# EAGLE schematic LED_Heart (EAGLE 7.7.0)
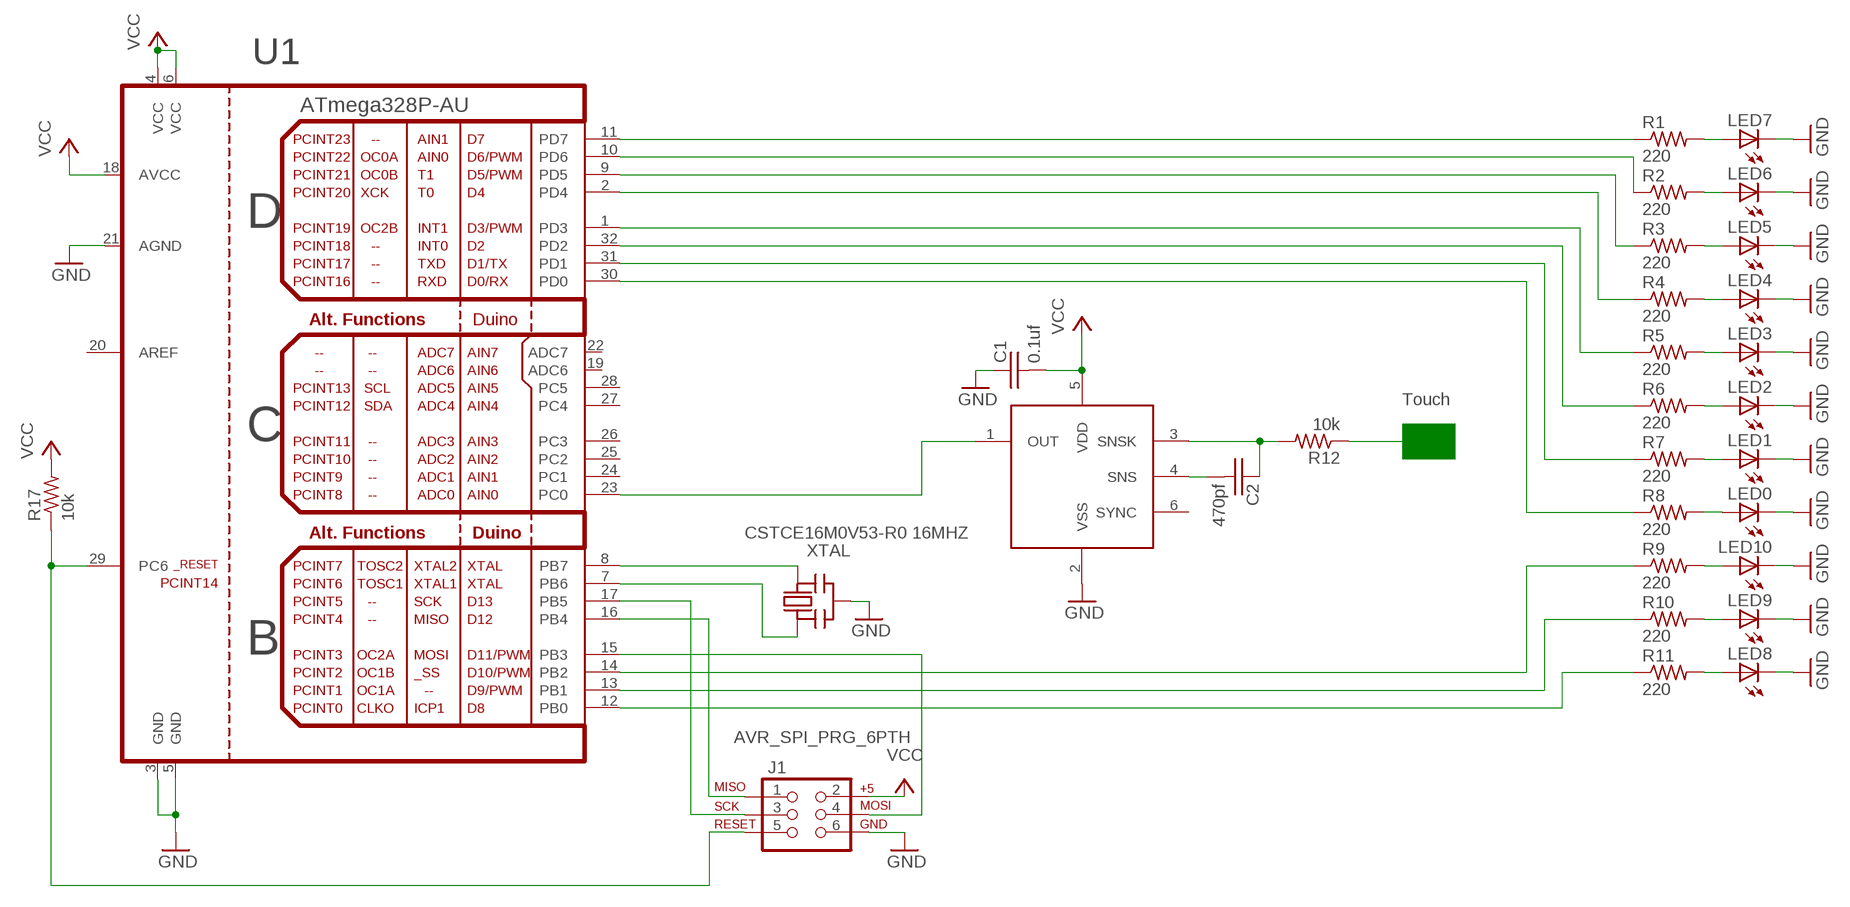
[diagram p0: schematic, sheet 1]

## Parts
C1  0.1uf  C-USC0603  [C0603]
C2  470pf  C-USC0603  [C0603]
J1  AVR_SPI_PRG_6PTH  [2X3]
LED0  LED0603  [LED-0603]
LED1  LED0603  [LED-0603]
LED2  LED0603  [LED-0603]
LED3  LED0603  [LED-0603]
LED4  LED0603  [LED-0603]
LED5  LED0603  [LED-0603]
LED6  LED0603  [LED-0603]
LED7  LED0603  [LED-0603]
LED8  LED0603  [LED-0603]
LED9  LED0603  [LED-0603]
LED10  LED0603  [LED-0603]
R1  220  R-US_R0402  [R0402]
R2  220  R-US_R0402  [R0402]
R3  220  R-US_R0402  [R0402]
R4  220  R-US_R0402  [R0402]
R5  220  R-US_R0402  [R0402]
R6  220  R-US_R0402  [R0402]
R7  220  R-US_R0402  [R0402]
R8  220  R-US_R0402  [R0402]
R9  220  R-US_R0402  [R0402]
R10  220  R-US_R0402  [R0402]
R11  220  R-US_R0402  [R0402]
R12  10k  R-US_R0402  [R0402]
R17  10k  R-US_R0402  [R0402]
U1  ATmega328P-AU  ATMEGA328  [TQFP-32-08]
U$1  QT100  [SOT23-6]
XTAL  CSTCE16M0V53-R0 16MHZ  CERMOSCILL-THM  [CERM_OSC]

## Nets
GND: C1.1 J1.6 LED0.C LED1.C LED2.C LED3.C LED4.C LED5.C LED6.C LED7.C LED8.C LED9.C LED10.C U1.3(GND) U1.5(GND) U1.21(AGND) U$1.2(VSS) XTAL.P$2(GND)
N$1: LED1.A R7.2
N$2: LED6.A R2.2
N$3: R9.1 U1.14(PB2)
N$4: U1.23(PC0) U$1.1(OUT)
N$6: C2.2 U$1.4(SNS)
N$7: C2.1 R12.2 U$1.3(SNSK)
N$8: R12.1
N$11: LED8.A R11.2
N$12: LED9.A R10.2
N$16: LED10.A R9.2
N$17: LED0.A R8.2
N$20: R10.1 U1.13(PB1)
N$22: LED2.A R6.2
N$23: LED3.A R5.2
N$28: LED5.A R3.2
N$30: R11.1 U1.12(PB0)
N$31: LED7.A R1.2
N$32: LED4.A R4.2
N$34: J1.5 R17.1 U1.29(PC6)
N$35: J1.3 U1.17(PB5)
N$36: J1.1 U1.16(PB4)
N$39: J1.4 U1.15(PB3)
PD0: R8.1 U1.30(PD0)
PD1: R7.1 U1.31(PD1)
PD2: R6.1 U1.32(PD2)
PD3: R5.1 U1.1(PD3)
PD4: R4.1 U1.2(PD4)
PD5: R3.1 U1.9(PD5)
PD6: R2.1 U1.10(PD6)
PD7: R1.1 U1.11(PD7)
VCC: C1.2 J1.2 R17.2 U1.4(VCC) U1.6(VCC) U1.18(AVCC) U$1.5(VDD)
XTAL1: U1.7(PB6) XTAL.P$1(IN)
XTAL2: U1.8(PB7) XTAL.P$3(OUT)
Unconnected: U1.19(ADC6) U1.20(AREF) U1.22(ADC7) U1.24(PC1) U1.25(PC2) U1.26(PC3) U1.27(PC4) U1.28(PC5) U$1.6(SYNC)

## Notes on the sheet
- Touch

## Library data of the parts
C1 C2 = SYNShop:C-US: CAPACITOR, American symbol
J1 = SparkFun:AVR_SPI_PRG_6: AVR ISP 6 Pin This is the reduced ISP connector for AVR programming. Common on Arduino. This footprint will take up less PCB space and can be used with a 10-pin to 6-pin adapter such as SKU: BOB-08508
LED0 LED1-LED10 = SparkFun:LED: LEDs Standard schematic elements and footprints for 5mm, 3mm, 1206, and 0603 sized LEDs. 5mm - Spark Fun Electronics SKU : COM-00529 (and others)
R1-R12 R17 = resistor:R-US_: RESISTOR, American symbol
U1 = atmel-atmega:ATMEGA328
U$1 = SYNShop:QT100
XTAL = adafruit:CERMOSCILL: Ceramic oscillator with built in capacitors such as ZTT-12MHz http://www.ladyada.net/library/eagle

## Net classes
0 default: clearance 0.205 mm